# EAGLE board badge (EAGLE 8.3.1)
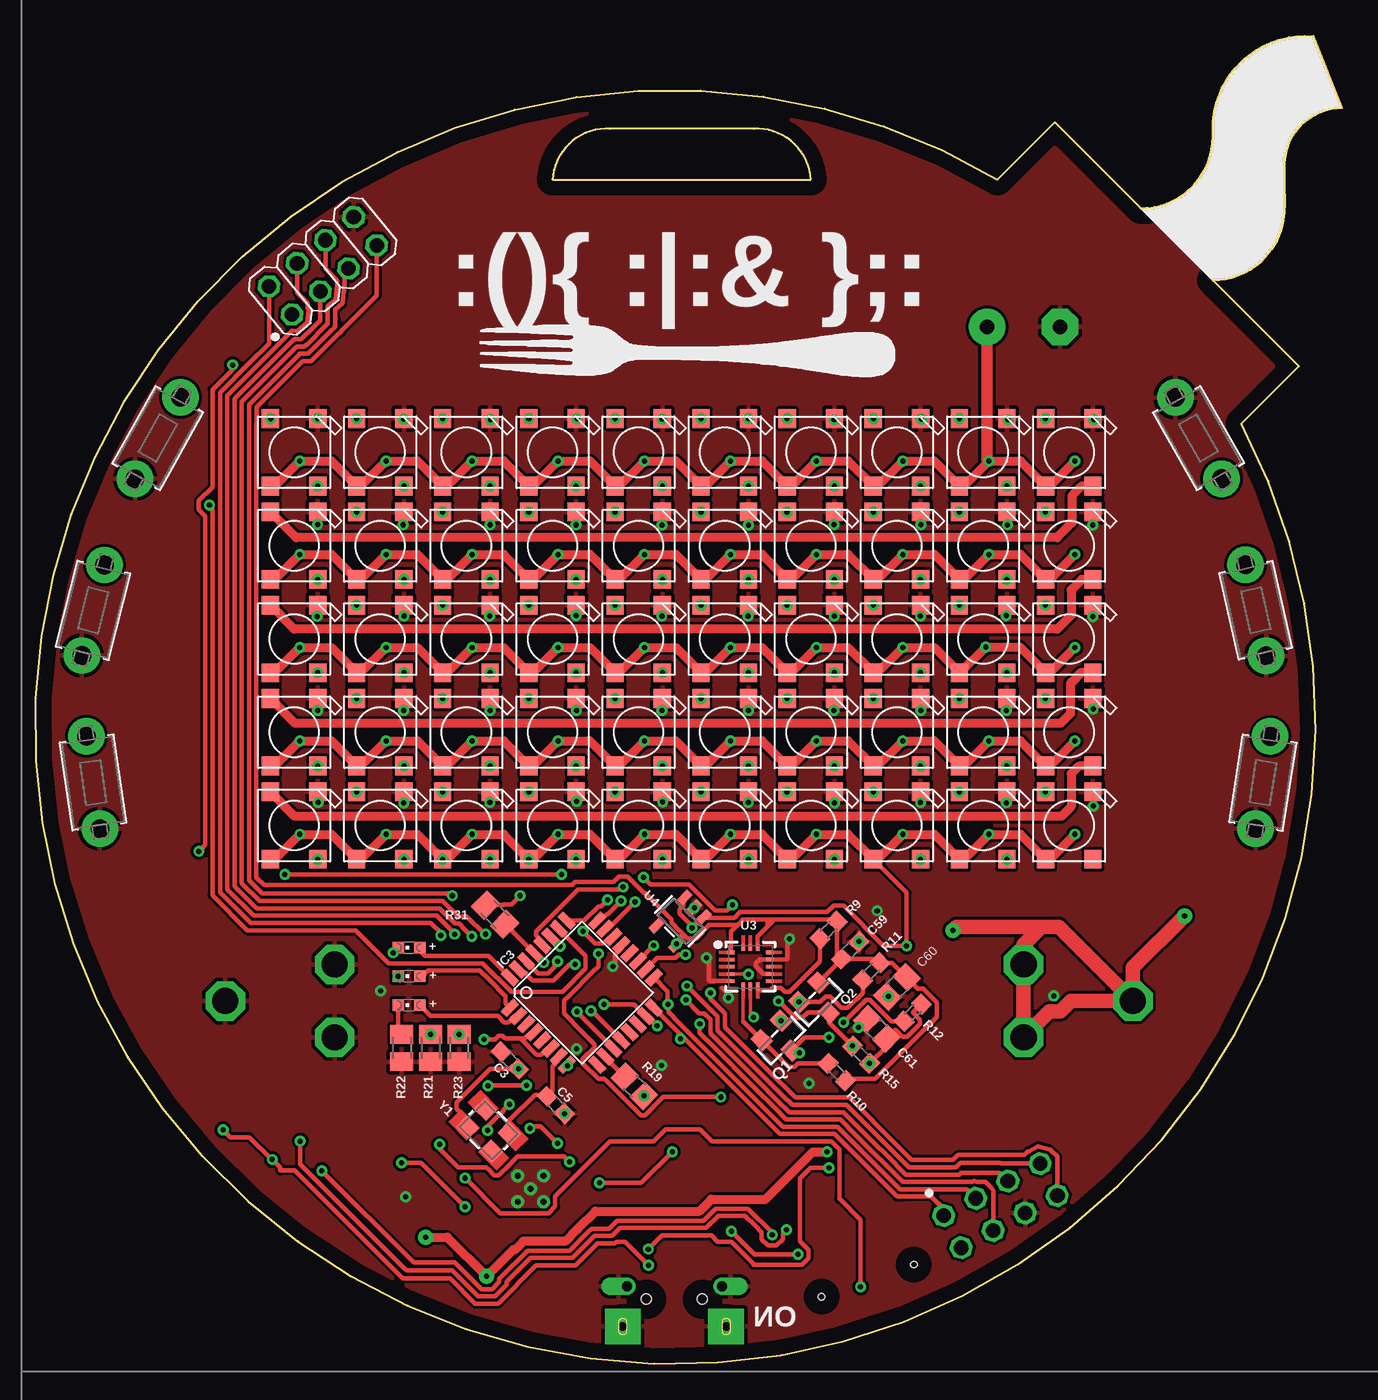
[diagram p2: board, top side]
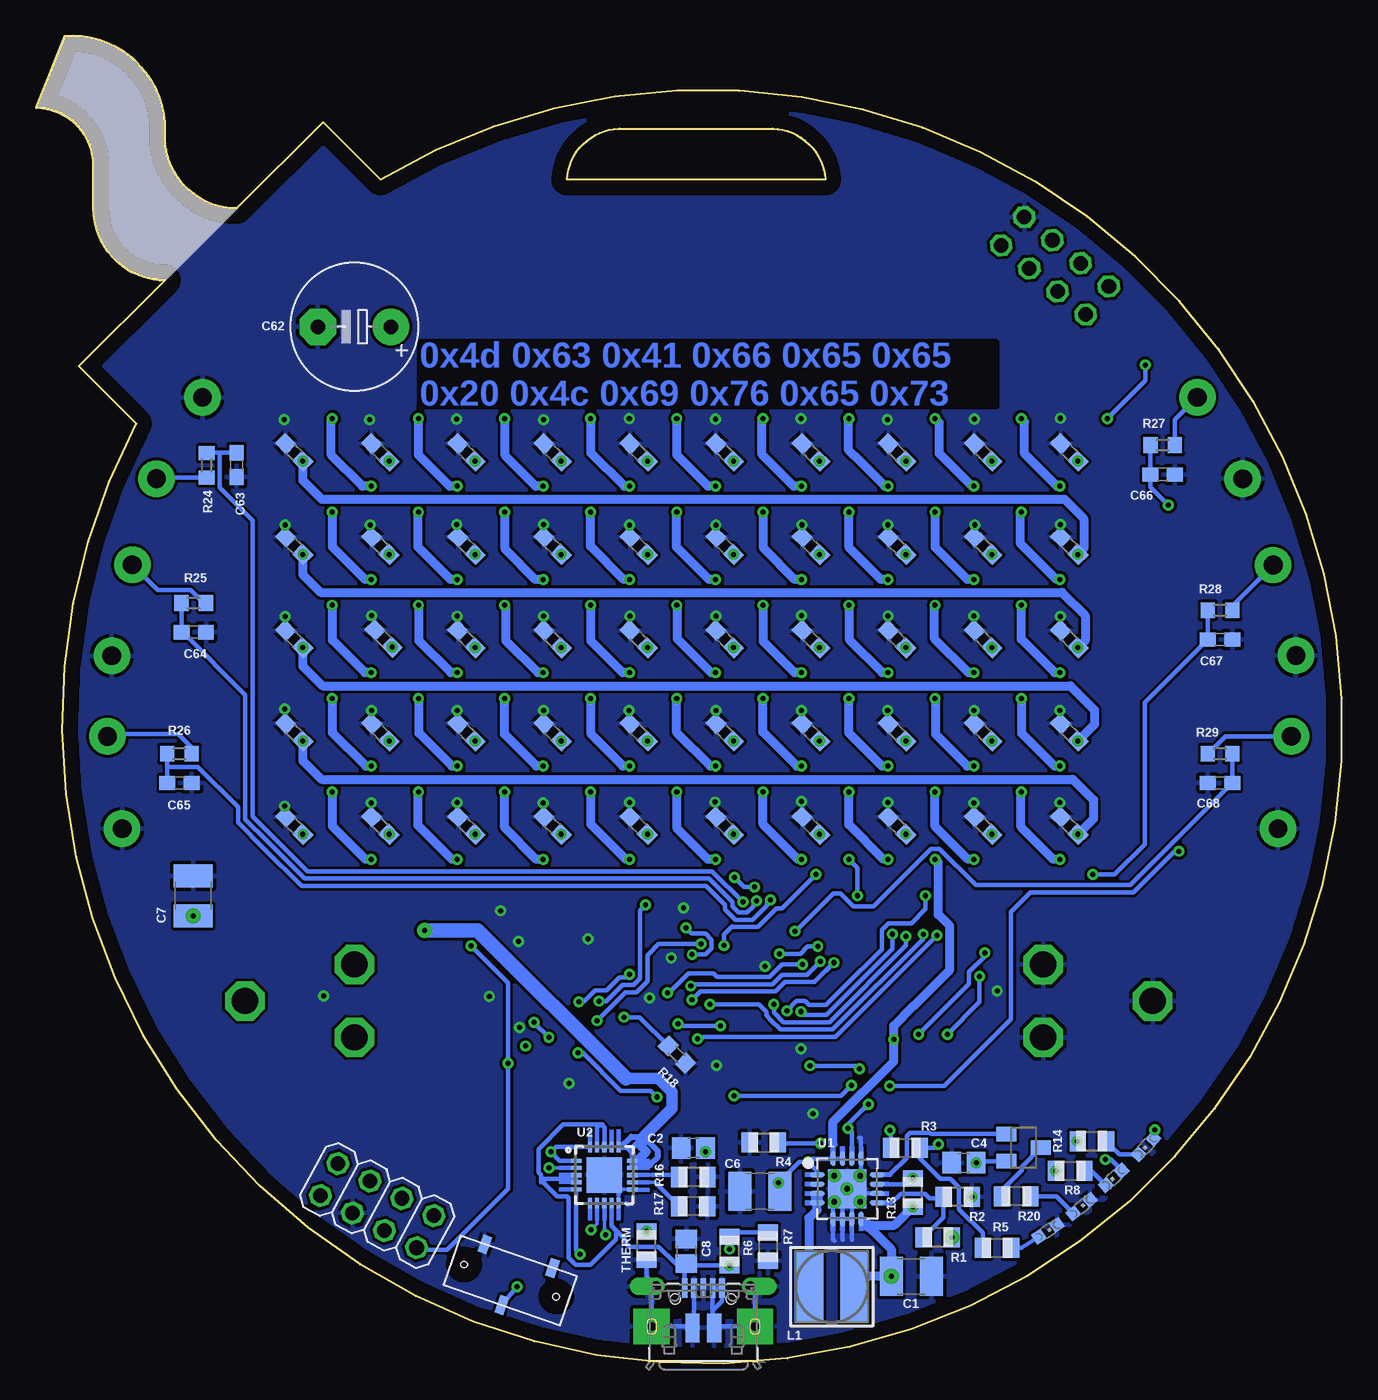
[diagram p3: board, bottom side, seen from below]

Size 90.99 x 92.5 mm. Coordinates in mm from the lower left corner, seen from the top.
Outline: 11.63,14.43 arc-163 66.99,82.48 70.99,86.48 76.99,80.48 arc90 81.99,85.48 81.99,86.48 arc-90 88.99,92.48 90.99,87.48 arc90 86.99,83.48 86.99,80.48 arc-90 81.99,75.48 87.99,69.48 83.99,65.48 arc-165 11.63,14.43
Outline: 40.01,86.03 arc90 35.99,82.48 53.99,82.48 arc90 50.01,86.03 40.01,86.03
Copper layers (1*16): Top 0.035mm / dielectric 1.5mm / Bottom 0.035mm
Design rules "default *": minimum track width 8mil, minimum drill 0.35mm, track to track 8mil, track to pad 8mil, pad to pad 8mil, via to via 8mil, smd to smd 0mil, copper to edge 40mil, drill to drill 8mil, minimum pad ring 10mil, minimum via ring 8mil, stop-mask expansion 4mil, vias tented up to drill 0mil, thermal gap 10mil

## Footprints (pad centres in the part's own frame; a part is rotated, then mirrored left to right if it is on the bottom)
C1210 = smd 1.6 x 2.7: 1 -1.4,0; 2 1.4,0
C0805 = smd 1.3 x 1.5: 1 -0.85,0; 2 0.85,0
C0603 = smd 1.1 x 1: 1 -0.85,0; 2 0.85,0
C0805' = smd 1.3 x 1.5: 1 -0.95,0; 2 0.95,0
E5-8,5 = drill 1.016 pad 2.54: + -2.54,0 | drill 1.016 pad 2.54 octagon: - 2.54,0
ADAFRUIT_CHIPLED_0603 = smd 0.8 x 0.8: A 0,-0.75; C 0,0.75
4UCONN_20329 = smd 1 x 2: BASE@1 -0.75,-2; BASE@2 0.75,-2 | smd 0.4 x 1.35: D+ 0,0.775; D- -0.65,0.775; GND 1.3,0.775; ID 0.65,0.775; VBUS -1.3,0.775 | drill 0.7 offset: SPRT@1 -3.3,0.9; SPRT@2 3.3,0.9 | drill 0.6 pad 2.5 square: SPRT@3 -3.6,-1.9; SPRT@4 3.6,-1.9 | hole 0.7: -1.95,0; 1.95,0
TQFP32-08 = smd 1.27 x 0.559: 1 -4.293,2.8; 2 -4.293,2; 3 -4.293,1.2; 4 -4.293,0.4; 5 -4.293,-0.4; 6 -4.293,-1.2; 7 -4.293,-2; 8 -4.293,-2.8; 17 4.293,-2.8; 18 4.293,-2; 19 4.293,-1.2; 20 4.293,-0.4; 21 4.293,0.4; 22 4.293,1.2; 23 4.293,2; 24 4.293,2.8 | smd 0.559 x 1.27: 9 -2.8,-4.293; 10 -2,-4.293; 11 -1.2,-4.293; 12 -0.4,-4.293; 13 0.4,-4.293; 14 1.2,-4.293; 15 2,-4.293; 16 2.8,-4.293; 25 2.8,4.293; 26 2,4.293; 27 1.2,4.293; 28 0.4,4.293; 29 -0.4,4.293; 30 -1.2,4.293; 31 -2,4.293; 32 -2.8,4.293
2X04 = drill 1.016 octagon: 1 -3.81,-1.27; 2 -3.81,1.27; 3 -1.27,-1.27; 4 -1.27,1.27; 5 1.27,-1.27; 6 1.27,1.27; 7 3.81,-1.27; 8 3.81,1.27
INDUCTOR_5X5MM_TDK_VLC5045 = smd 2 x 5: P$1 -1.6,0; P$2 1.6,0
WS2812B-NARROW = smd 1.3 x 1.2: 1-VDD 2.35,-1.65; 2-DOUT 2.35,1.65; 3-GND -2.35,1.65; 4-DIN -2.35,-1.65
SOT23-WIDE = smd 1 x 1.2: 1 -0.95,-1; 2 0.95,-1; 3 0,1
R0805 = smd 1.1 x 1.4: 1 -1,0; 2 1,0
R0603 = smd 1 x 1.1: 1 -0.85,0; 2 0.85,0
R0805' = smd 1.3 x 1.5: 1 -0.95,0; 2 0.95,0
M0805 = smd 1.3 x 1.6: 1 -0.95,0; 2 0.95,0
TACT_PANA-EVQ = drill 1.3 pad 2.54: P$1 -3.25,0; P$2 3.25,0
TRANSISTOR_SC59-BEC = smd 1 x 1.4: B -0.95,-1.2; C 0,1.2; E 0.95,-1.2
PVQFN-16 = smd 1.05 x 0.35: 1 -2.1,0.975; 2 -2.1,0.325; 3 -2.1,-0.325; 4 -2.1,-0.975; 9 2.1,-0.975; 10 2.1,-0.325; 11 2.1,0.325; 12 2.1,0.975 | smd 0.35 x 1.05: 5 -0.975,-2.1; 6 -0.325,-2.1; 7 0.325,-2.1; 8 0.975,-2.1; 13 0.975,2.1; 14 0.325,2.1; 15 -0.325,2.1; 16 -0.975,2.1 | drill 0.4: P$18 0,0; P$19 -0.9,0.9; P$20 0.9,0.9; P$21 0.9,-0.9; P$22 -0.9,-0.9 | smd 2.7 x 2.7: THERMAL 0,0
QFN20_4MM = smd 0.73 x 0.28: P$1 -1.965,1; P$2 -1.965,0.5; P$3 -1.965,0; P$4 -1.965,-0.5; P$5 -1.965,-1; P$11 1.965,-1; P$12 1.965,-0.5; P$13 1.965,0; P$14 1.965,0.5; P$15 1.965,1 | smd 0.28 x 0.73: P$6 -1,-1.965; P$7 -0.5,-1.965; P$8 0,-1.965; P$9 0.5,-1.965; P$10 1,-1.965; P$16 1,1.965; P$17 0.5,1.965; P$18 0,1.965; P$19 -0.5,1.965; P$20 -1,1.965 | smd 2.5 x 2.5: P$21 0,0
LGA16_3X3MM = smd 0.5 x 0.25: 1 -1.35,1; 2 -1.35,0.5; 3 -1.35,0; 4 -1.35,-0.5; 5 -1.35,-1; 9 1.35,-1; 10 1.35,-0.5; 11 1.35,0; 12 1.35,0.5; 13 1.35,1 | smd 0.25 x 0.5: 6 -0.5,-1.35; 7 0,-1.35; 8 0.5,-1.35; 14 0.5,1.35; 15 0,1.35; 16 -0.5,1.35
SOT23-5 = smd 0.55 x 1.2: 1 -0.95,-1.3; 2 0,-1.3; 3 0.95,-1.3; 4 0.95,1.3; 5 -0.95,1.3
CL-SB-12A-02T = smd 0.635 x 1.27: P$1 -2.5,-1.8; P$2 0,1.8; P$3 2.5,-1.8 | hole 0.45: 3.4,0; -3.4,0
54_BATTERY_CLIP = drill 1.83 octagon: P$1 -24,2.54; P$2 -24,-2.54; P$3 -31.62,0; P$4 24,2.54; P$5 24,-2.54; P$6 31.62,0
CRYSTAL-SMD-3.2X2.5MM = smd 1.2 x 1.1: 1 -1.175,-0.875; 2 1.175,-0.875; 3 1.175,0.875; 4 -1.175,0.875

## Placement (x,y rotation side)
C1  10uF  [C1210]  30,6.08 0 bottom
C2  2.2uF  [C0805]  45.19,15.03 180 bottom
C3  22pF  [C0603]  33.01,21.13 135 top
C4  0.1uF  [C0805]  26.33,13.99 180 bottom
C5  22pF  [C0603]  36.22,18.02 315 top
C6  10uF  [C1210]  40.55,12 180 bottom
C7  10uF  [C1210]  80.03,32.59 90 bottom
C8  10uf  [C0805]  45.67,7.83 90 bottom
C9  100nF  [C0603]  18.99,63.48 135 bottom
C10  100nF  [C0603]  30.99,63.48 135 bottom
C11  100nF  [C0603]  36.99,63.48 135 bottom
C12  100nF  [C0603]  42.99,63.48 135 bottom
C13  100nF  [C0603]  48.99,63.48 135 bottom
C14  100nF  [C0603]  54.99,63.48 135 bottom
C15  100nF  [C0603]  60.99,63.48 135 bottom
C16  100nF  [C0603]  66.99,63.48 135 bottom
C17  100nF  [C0603]  72.99,63.48 135 bottom
C18  100nF  [C0603]  18.99,56.98 135 bottom
C19  100nF  [C0603]  24.99,56.98 135 bottom
C20  100nF  [C0603]  30.99,56.98 135 bottom
C21  100nF  [C0603]  36.99,56.98 135 bottom
C22  100nF  [C0603]  42.99,56.98 135 bottom
C23  100nF  [C0603]  48.99,56.98 135 bottom
C24  100nF  [C0603]  54.99,56.98 135 bottom
C25  100nF  [C0603]  60.99,56.98 135 bottom
C26  100nF  [C0603]  66.99,56.98 135 bottom
C27  100nF  [C0603]  72.99,56.98 135 bottom
C28  100nF  [C0603]  18.99,50.48 135 bottom
C29  100nF  [C0603]  24.99,50.48 135 bottom
C30  100nF  [C0603]  30.99,50.48 135 bottom
C31  100nF  [C0603]  36.99,50.48 135 bottom
C32  100nF  [C0603]  42.99,50.48 135 bottom
C33  100nF  [C0603]  48.99,50.48 135 bottom
C34  100nF  [C0603]  54.99,50.48 135 bottom
C35  100nF  [C0603]  60.99,50.48 135 bottom
C36  100nF  [C0603]  66.77,50.51 135 bottom
C37  100nF  [C0603]  72.99,50.48 135 bottom
C38  100nF  [C0603]  18.99,43.98 135 bottom
C39  100nF  [C0603]  24.99,43.98 135 bottom
C40  100nF  [C0603]  30.99,43.98 135 bottom
C41  100nF  [C0603]  36.99,43.98 135 bottom
C42  100nF  [C0603]  42.99,43.98 135 bottom
C43  100nF  [C0603]  48.99,43.98 135 bottom
C44  100nF  [C0603]  54.99,43.98 135 bottom
C45  100nF  [C0603]  60.99,43.98 135 bottom
C46  100nF  [C0603]  66.99,43.98 135 bottom
C47  100nF  [C0603]  72.99,43.98 135 bottom
C48  100nF  [C0603]  18.99,37.48 135 bottom
C49  100nF  [C0603]  24.99,37.48 135 bottom
C50  100nF  [C0603]  30.99,37.48 135 bottom
C51  100nF  [C0603]  36.99,37.48 135 bottom
C52  100nF  [C0603]  42.99,37.48 135 bottom
C53  100nF  [C0603]  48.99,37.48 135 bottom
C54  100nF  [C0603]  54.99,37.48 135 bottom
C55  100nF  [C0603]  60.99,37.48 135 bottom
C56  100nF  [C0603]  66.99,37.48 135 bottom
C57  100nF  [C0603]  72.99,37.48 135 bottom
C58  100nF  [C0603]  24.99,63.48 135 bottom
C59  0.1uF  [C0603]  56.73,28.79 45 top
C60  10µF  [C0805']  59.99,26.24 225 top
C61  10µF  [C0805']  58.58,23.32 135 top
C62  1F  [E5-8,5]  68.81,72.24 180 bottom
C63  100nF  [C0603]  77,62.61 270 bottom
C64  100nF  [C0603]  79.99,50.96 0 bottom
C65  100nF  [C0603]  80.99,40.45 0 bottom
C66  100nF  [C0603]  12.49,61.94 0 bottom
C67  100nF  [C0603]  8.49,50.44 0 bottom
C68  100nF  [C0603]  8.49,40.45 180 bottom
CHRG/LBO  ORANGE  [ADAFRUIT_CHIPLED_0603]  15.89,12.94 132.8 bottom
CN4  MicroUSB  [4UCONN_20329]  44.49,4.48 0 bottom
DONE  GREEN  [ADAFRUIT_CHIPLED_0603]  13.65,15.13 136.3 bottom
IC3  MEGA8-AI  [TQFP32-08]  38.04,25.84 45 top
JP1  PROG_HEADER  [2X04]  67.21,11 151.5 bottom
JP3  TCVR_HEADER  [2X04]  19.99,76.48 39.3 top
L1  6.8uH  [INDUCTOR_5X5MM_TDK_VLC5045]  35.54,5.36 180 bottom
LBO  RED  [ADAFRUIT_CHIPLED_0603]  18.13,10.94 309.5 bottom
LED1  WS2812B5050-NARROW  [WS2812B-NARROW]  17.99,63.48 270 top
LED2  WS2812B5050-NARROW  [WS2812B-NARROW]  23.99,63.48 270 top
LED3  WS2812B5050-NARROW  [WS2812B-NARROW]  29.99,63.48 270 top
LED4  WS2812B5050-NARROW  [WS2812B-NARROW]  35.99,63.48 270 top
LED5  WS2812B5050-NARROW  [WS2812B-NARROW]  41.99,63.48 270 top
LED6  WS2812B5050-NARROW  [WS2812B-NARROW]  47.99,63.48 270 top
LED7  WS2812B5050-NARROW  [WS2812B-NARROW]  53.99,63.48 270 top
LED8  WS2812B5050-NARROW  [WS2812B-NARROW]  59.99,63.48 270 top
LED9  WS2812B5050-NARROW  [WS2812B-NARROW]  65.99,63.48 270 top
LED10  WS2812B5050-NARROW  [WS2812B-NARROW]  71.99,63.48 270 top
LED11  WS2812B5050-NARROW  [WS2812B-NARROW]  17.99,56.98 270 top
LED12  WS2812B5050-NARROW  [WS2812B-NARROW]  23.99,56.98 270 top
LED13  WS2812B5050-NARROW  [WS2812B-NARROW]  29.99,56.98 270 top
LED14  WS2812B5050-NARROW  [WS2812B-NARROW]  35.99,56.98 270 top
LED15  WS2812B5050-NARROW  [WS2812B-NARROW]  41.99,56.98 270 top
LED16  WS2812B5050-NARROW  [WS2812B-NARROW]  47.99,56.98 270 top
LED17  WS2812B5050-NARROW  [WS2812B-NARROW]  53.99,56.98 270 top
LED18  WS2812B5050-NARROW  [WS2812B-NARROW]  59.99,56.98 270 top
LED19  WS2812B5050-NARROW  [WS2812B-NARROW]  65.99,56.98 270 top
LED20  WS2812B5050-NARROW  [WS2812B-NARROW]  71.99,56.98 270 top
LED21  WS2812B5050-NARROW  [WS2812B-NARROW]  17.99,50.48 270 top
LED22  WS2812B5050-NARROW  [WS2812B-NARROW]  23.99,50.48 270 top
LED23  WS2812B5050-NARROW  [WS2812B-NARROW]  29.99,50.48 270 top
LED24  WS2812B5050-NARROW  [WS2812B-NARROW]  35.99,50.48 270 top
LED25  WS2812B5050-NARROW  [WS2812B-NARROW]  41.99,50.48 270 top
LED26  WS2812B5050-NARROW  [WS2812B-NARROW]  47.99,50.48 270 top
LED27  WS2812B5050-NARROW  [WS2812B-NARROW]  53.99,50.48 270 top
LED28  WS2812B5050-NARROW  [WS2812B-NARROW]  59.99,50.48 270 top
LED29  WS2812B5050-NARROW  [WS2812B-NARROW]  65.99,50.48 270 top
LED30  WS2812B5050-NARROW  [WS2812B-NARROW]  71.99,50.48 270 top
LED31  WS2812B5050-NARROW  [WS2812B-NARROW]  17.99,43.98 270 top
LED32  WS2812B5050-NARROW  [WS2812B-NARROW]  23.99,43.98 270 top
LED33  WS2812B5050-NARROW  [WS2812B-NARROW]  29.99,43.98 270 top
LED34  WS2812B5050-NARROW  [WS2812B-NARROW]  35.99,43.98 270 top
LED35  WS2812B5050-NARROW  [WS2812B-NARROW]  41.99,43.98 270 top
LED36  WS2812B5050-NARROW  [WS2812B-NARROW]  47.99,43.98 270 top
LED37  WS2812B5050-NARROW  [WS2812B-NARROW]  53.99,43.98 270 top
LED38  WS2812B5050-NARROW  [WS2812B-NARROW]  59.99,43.98 270 top
LED39  WS2812B5050-NARROW  [WS2812B-NARROW]  65.99,43.98 270 top
LED40  WS2812B5050-NARROW  [WS2812B-NARROW]  71.99,43.98 270 top
LED41  WS2812B5050-NARROW  [WS2812B-NARROW]  17.99,37.48 270 top
LED42  WS2812B5050-NARROW  [WS2812B-NARROW]  23.99,37.48 270 top
LED43  WS2812B5050-NARROW  [WS2812B-NARROW]  29.99,37.48 270 top
LED44  WS2812B5050-NARROW  [WS2812B-NARROW]  35.99,37.48 270 top
LED45  WS2812B5050-NARROW  [WS2812B-NARROW]  41.99,37.48 270 top
LED46  WS2812B5050-NARROW  [WS2812B-NARROW]  47.99,37.48 270 top
LED47  WS2812B5050-NARROW  [WS2812B-NARROW]  53.99,37.48 270 top
LED48  WS2812B5050-NARROW  [WS2812B-NARROW]  59.99,37.48 270 top
LED49  WS2812B5050-NARROW  [WS2812B-NARROW]  65.99,37.48 270 top
LED50  WS2812B5050-NARROW  [WS2812B-NARROW]  71.99,37.48 270 top
ON  BLUE  [ADAFRUIT_CHIPLED_0603]  20.49,9.26 303.2 bottom
Q1  BSS138  [SOT23-WIDE]  51.94,22.51 225 top
Q2  BSS138  [SOT23-WIDE]  54.54,25.17 225 top
R1  1.87M  [R0805]  28.16,8.81 0 bottom
R2  340K  [R0805]  26.77,11.61 180 bottom
R3  1.87M  [R0805]  30.41,15.03 0 bottom
R4  200K  [R0805]  40.27,15.4 0 bottom
R5  1K  [R0805]  24.03,8.07 0 bottom
R6  270K  [R0805]  42.68,7.85 270 bottom
R7  100K  [R0805]  39.99,8.15 270 bottom
R8  1K  [R0805]  18.92,13.44 0 bottom
R9  10K  [R0603]  55.23,30.22 225 top
R10  10K  [R0603]  55.8,20.31 315 top
R11  10K  [R0603]  58.21,27.33 45 top
R12  10K  [R0603]  61.09,24.45 45 top
R13  200K  [R0805]  29.89,11.93 90 bottom
R14  1K  [R0805]  17.42,15.5 0 bottom
R15  10K  [R0603]  57.49,21.52 315 top
R16  1.0K  [R0805]  45.18,13 180 bottom
R17  100K  [R0805]  45.2,10.97 180 bottom
R18  10K  [R0603]  46.33,21.53 135 bottom
R19  470  [R0805']  41.69,19.32 315 top
R20  1K  [R0805]  22.68,11.65 180 bottom
R21  220  [M0805]  27.49,21.98 90 top
R22  220  [M0805]  25.49,21.98 90 top
R23  220  [M0805]  29.49,21.98 90 top
R24  1k  [R0603]  79.09,62.58 270 bottom
R25  1k  [R0603]  79.99,52.98 0 bottom
R26  1k  [R0603]  80.99,42.48 0 bottom
R27  1k  [R0603]  12.49,63.98 0 bottom
R28  1k  [R0603]  8.49,52.48 0 bottom
R29  1k  [R0603]  8.49,42.48 180 bottom
R31  10k  [M0805]  32,31.28 135 top
STAT1  GREEN  [ADAFRUIT_CHIPLED_0603]  25.99,28.98 90 top
STAT2  GREEN  [ADAFRUIT_CHIPLED_0603]  25.99,26.98 90 top
STAT3  GREEN  [ADAFRUIT_CHIPLED_0603]  25.99,24.98 90 top
SW1  [TACT_PANA-EVQ]  80.99,64.48 299.6 top
SW2  [TACT_PANA-EVQ]  84.99,52.48 102.7 top
SW3  [TACT_PANA-EVQ]  85.49,40.48 81 top
SW4  [TACT_PANA-EVQ]  8.49,64.48 60.9 top
SW5  [TACT_PANA-EVQ]  3.99,52.48 75.9 top
SW6  [TACT_PANA-EVQ]  3.99,40.48 98.2 top
T1  MMUN2133LT1G  [TRANSISTOR_SC59-BEC]  22.17,15.05 270 bottom
THERM  15K  [R0805]  48.45,8.23 90 bottom
U1  TPS61090RSAR  [PVQFN-16]  34.47,12.18 0 bottom
U2  MCP73871  [QFN20_4MM]  51.39,13.14 0 bottom
U3  LIS3DHTR  [LGA16_3X3MM]  49.78,27.65 0 top
U4  MIC5225-3.3  [SOT23-5]  44.89,30.82 135 top
U$17  CL-SB-12A-02T  [CL-SB-12A-02T]  57.95,5.78 160.8 bottom
U$22  54_BATTERY_CLIP  [54_BATTERY_CLIP]  44.81,25.27 180 top
Y1  16.00MHz  [CRYSTAL-SMD-3.2X2.5MM]  31.53,16.26 315 top

## Tracks (layer width: path | path; a pad name or v marks a point on that pad's centre or on a via)
3.3V  (via drill 0.35 pad 0.6)
  Top 0.305: U3.14 50.28,29.77 50.98,30.48 | 50.98,30.48 51.45,30.95 | 51.45,30.95 55.7,30.95 R9.1 55.83,28.5 C59.1 | C59.1 56.13,28.17 Q2.1 | C59.1 58.55,28.19 R11.2 59.65,27.93 C60.1 61.47,26.11 61.51,26.15 61.8,26.15 62.79,25.17 62.79,24.57 62.79,24.15 58.46,19.82 56.51,19.82 R10.2 | 44.66,29.21 U4.5 | 50.98,30.95 49.28,30.95 49.08,30.75 | 50.98,30.95 51.45,30.95 | 49.08,30.75 48.43,30.1 U3.1 | 50.98,30.95 50.98,30.48 | 44.56,29.1 44.66,29.21 | 44.66,29.21 44.98,29.52 44.98,30.04 44.86,30.16 | 44.86,30.16 44.27,30.74 44.27,30.95 42.42,32.8 42.36,32.8 41.22,33.93 40.62,33.93 40.24,33.56 37.57,33.56 37.34,33.33 15.91,33.33 15.36,33.88 15.36,65.48 15.39,65.51 15.39,66.63 18.6,69.84 18.63,69.84 | 49.08,30.75 | 49.08,30.75 48.89,30.56 46.91,30.56 46.44,30.09 46.44,30.05 46.01,29.62 45.41,29.62 44.87,30.16 44.86,30.16 | JP3.7 23.74,74.42 21.29,71.97 21.29,71.94 21.27,71.92 21.27,71.89 | 18.63,69.84 | 18.63,69.84 19.17,69.84 20.98,71.65 21.26,71.89 | 21.27,71.89 | 21.27,71.89 | 21.27,71.89 21.26,71.89 | 21.26,71.89
  Bottom 0.305: U4.5 47.61,29.23 48.4,28.45 48.4,26.61 49.13,25.88 49.92,25.88 Q1.1
  other vias: 51.9,23.89 44.64,29.23
+5V  (via drill 0.35, 0.35 pad 0.6)
  Top 0.305: 32.96,13.83 32.23,13.11 31.93,13.12 31.57,13.5 31.37,13.69 29.4,13.69 28.12,14.97 v28.12,15.27 | v37.18,14.05 36.79,14.44 33.57,14.44 33.33,14.19 32.96,13.83 | 32.96,13.83 | IC3.4 34.49,23.09 34.05,22.66 33.76,22.66 | IC3.6 35.62,21.96 35.19,21.52 34.89,21.52 33.76,22.66 | 46.5,31.07 U4.1 | R12.2 61.09,24.46 61.59,23.96 61.59,23.67 60.67,22.75 60.38,22.75 59.88,23.25 59.29,22.65 C61.1 59.25,22.08 R15.2 | U4.1 46.42,31.07 v45.71,30.36 45.71,30.49 44.83,31.36 44.83,31.66 45.14,31.96 U4.3 | v39.26,12.59 42.17,12.59 v44.34,14.75 | R31.2 32.59,31.95 32.63,31.99 33.13,31.99 v33.74,32.6 | LED48.1-VDD 60.66,32.81 v60.66,29.11 59.06,29.11 56.25,31.92 55.58,31.92 55.13,31.46 49.07,31.46 48.68,31.07 U4.1 | v31.23,22.6 32,22.6 32.23,22.83 32.52,22.83 32.7,22.66 33.76,22.66 | v45.27,28.5 44.8,28.5 44.56,28.26 43.28,28.26 IC3.18
  Top 0.61: LED1.1-VDD 16.64,61.13 C9.1 20.59,62.88 LED2.1-VDD 22.64,61.13 C58.1 26.59,62.88 LED3.1-VDD 28.64,61.13 C10.1 32.59,62.88 LED4.1-VDD 34.64,61.13 C11.1 38.59,62.88 LED5.1-VDD 40.64,61.13 C12.1 44.59,62.88 LED6.1-VDD 46.64,61.13 C13.1 50.59,62.88 LED7.1-VDD 52.64,61.13 C14.1 56.59,62.88 LED8.1-VDD 58.64,61.13 C15.1 62.59,62.88 LED9.1-VDD 64.64,61.13 C16.1 68.59,62.88 LED10.1-VDD 70.64,61.13 C17.1 | LED11.1-VDD 16.64,54.63 C18.1 20.59,56.38 LED12.1-VDD 22.64,54.63 C19.1 26.59,56.38 LED13.1-VDD 28.64,54.63 C20.1 32.59,56.38 LED14.1-VDD 34.64,54.63 C21.1 38.59,56.38 LED15.1-VDD 40.64,54.63 C22.1 44.59,56.38 LED16.1-VDD 46.64,54.63 C23.1 50.59,56.38 LED17.1-VDD 52.64,54.63 C24.1 56.59,56.38 LED18.1-VDD 58.64,54.63 C25.1 62.59,56.38 LED19.1-VDD 64.64,54.63 C26.1 68.59,56.38 LED20.1-VDD 70.64,54.63 C27.1 | LED21.1-VDD 16.64,48.13 C28.1 20.59,49.88 LED22.1-VDD 22.64,48.13 C29.1 26.59,49.88 LED23.1-VDD 28.64,48.13 C30.1 32.59,49.88 LED24.1-VDD 34.64,48.13 C31.1 38.59,49.88 LED25.1-VDD 40.64,48.13 C32.1 44.59,49.88 LED26.1-VDD 46.64,48.13 C33.1 50.59,49.88 LED27.1-VDD 52.64,48.13 C34.1 56.59,49.88 LED28.1-VDD 58.64,48.13 C35.1 62.59,49.88 LED29.1-VDD 64.39,48.13 C36.1 68.56,49.91 LED30.1-VDD 70.64,48.13 C37.1 | LED31.1-VDD 16.64,41.63 C38.1 20.59,43.38 LED32.1-VDD 22.64,41.63 C39.1 26.59,43.38 LED33.1-VDD 28.64,41.63 C40.1 32.59,43.38 LED34.1-VDD 34.64,41.63 C41.1 38.59,43.38 LED35.1-VDD 40.64,41.63 C42.1 44.59,43.38 LED36.1-VDD 46.64,41.63 C43.1 50.59,43.38 LED37.1-VDD 52.64,41.63 C44.1 56.59,43.38 LED38.1-VDD 58.64,41.63 C45.1 62.59,43.38 LED39.1-VDD 64.64,41.63 C46.1 68.59,43.38 LED40.1-VDD 70.64,41.63 C47.1
  Top 0.61: C57.1 70.64,35.13 LED50.1-VDD 68.59,36.88 C56.1 64.64,35.13 LED49.1-VDD 62.59,36.88 C55.1 58.64,35.13 LED48.1-VDD 56.59,36.88 C54.1 52.64,35.13 LED47.1-VDD 50.59,36.88 C53.1 46.64,35.13 LED46.1-VDD 44.59,36.88 C52.1 40.64,35.13 LED45.1-VDD 38.59,36.88 C51.1 34.64,35.13 LED44.1-VDD 32.59,36.88 C50.1 28.64,35.13 LED43.1-VDD 26.59,36.88 C49.1 22.64,35.13 LED42.1-VDD 20.59,36.88 C48.1 16.64,35.13 LED41.1-VDD
  Top 0.813: C62.+ 66.27,63.01 C16.1
  Bottom 0.254: U1.16 35.45,15.28
  Bottom 0.305: U1.15 U1.16 36.95,14.28 v37.18,14.05 | U1.1 36.57,13.43 v37.18,14.05 | R5.1 25.03,9.12 26.67,10.77 26.67,12.3 27.26,12.88 27.98,12.88 29.41,14.32 R3.2 28.36,15.04 v28.12,15.27 | JP1.2 64.31,7.91 62.35,7.91 58.09,12.18 R15.2 58.09,26.53 v60.66,29.11 | v45.71,30.36 45.32,29.96 44.34,29.96 43.91,29.53 43.91,28.93 44.34,28.5 v45.27,28.5 | C6.1 39.15,12.48 v39.26,12.59 37.8,14.05 v37.18,14.05 | v33.74,32.6 33.74,34.54 LED44.1-VDD | C2.1 v44.34,14.75
  Bottom 0.61: C17.1 72.39,61.54 71.07,60.22 19.34,60.22 18.39,59.28 | 18.39,59.28 | 18.39,59.28 17.98,58.87 17.98,56.79 C18.1 | C27.1 72.39,54.97 71.15,53.74 19.51,53.74 17.88,52.11 17.88,50.39 C28.1 | C37.1 72.39,48.6 71.01,47.22 18.92,47.22 17.24,45.54 17.24,44.54 C38.1 | C47.1 72.39,42.01 71.09,40.71 18.75,40.71 17.31,39.28 17.31,37.96 C48.1 | 35.45,15.28 35.45,16.85 31.23,21.07 v31.23,22.6 31.23,23.55 29.87,24.9 29.86,24.9 27.33,27.44 27.33,30.49 28.13,31.29 28.13,34.92 LED43.1-VDD
  other vias: 18.39,62.88 24.39,62.88 30.39,62.88 36.39,62.88 42.39,62.88 48.39,62.88 54.39,62.88 60.39,62.88 66.39,62.88 72.39,62.88 18.39,56.38 24.39,56.38 30.39,56.38 36.39,56.38 42.39,56.38 48.39,56.38 54.39,56.38 60.39,56.38 66.39,56.38 72.39,56.38 18.39,49.88 24.39,49.88 30.39,49.88 36.39,49.88 42.39,49.88 48.39,49.88 54.39,49.88 60.39,49.88 66.17,49.91 72.39,49.88 18.39,43.38 24.39,43.38 30.39,43.38 36.39,43.38 42.39,43.38 48.39,43.38 54.39,43.38 60.39,43.38 66.39,43.38 72.39,43.38 18.39,36.88 24.39,36.88 30.39,36.88 36.39,36.88 42.39,36.88 48.39,36.88 54.39,36.88 60.39,36.88 66.39,36.88 72.39,36.88 58.09,20.92 28.34,35.13 34.34,35.13
BOOST_ENABLE  (via drill 0.35, 0.35 pad 0.6)
  Top 0.305: 39.54,15.02 | 39.54,15.02 40,15.49 43.03,15.49 43.86,16.31 46.28,16.31 47.1,15.49 55.42,15.49 55.97,14.93 55.97,11.47 56.01,11.47 57.46,10.03 v57.46,5.36 | R13.2 32.35,10.47 35.71,10.47 36.18,10.94 36.18,11.66 39.54,15.02
  Bottom 0.305: U1.11 30.32,12.5 R13.2 | v57.46,5.36 U$17.P$2
  other vias: 29.89,12.93
CE  (via drill 0.35 pad 0.6)
  Top 0.305: JP3.6 20.17,76.29 21,75.46 20.97,75.43 20.97,75.05 20.96,74.9 | v37.7,24.52 37.7,24.49 IC3.11 | 20.3,72.41 20.3,72.44 20.32,72.46 20.34,72.66 20.34,73.68 20.88,74.13 20.96,74.9 | 20.3,72.41 | 20.96,74.9 | 20.3,72.41 18.86,70.97 18.81,70.97 18.7,70.86 18.21,70.86 18.18,70.86 14.35,67.03 14.35,33.46 15.58,32.23 28.35,32.23 29.42,31.16 30.01,31.16 31.25,29.92 v31.33,29.92
  Bottom 0.305: v31.33,29.92 31.33,28.88 35.91,24.3 37.47,24.3 v37.7,24.52
CSN  (via drill 0.35 pad 0.6)
  Top 0.305: v38.67,24.58 38.74,24.58 IC3.12 | v29.01,32.6 28.86,32.76 15.77,32.76 14.86,33.67 14.86,66.82 18.33,70.29 | 20.8,72.2 20.78,72.18 20.78,72.15 20.64,72.03 | 20.8,72.2 | 20.8,72.2 | 20.8,72.2 20.81,72.23 20.85,72.27 20.85,72.64 20.87,72.82 20.85,72.84 20.85,73.44 21.36,73.87 | 21.36,73.87 | 21.36,73.87 21.41,74.28 21.44,74.66 21.48,74.7 21.48,75.02 21.48,75.05 | 21.48,75.05 | 21.48,75.05 21.5,75.21 21.48,75.23 21.51,75.25 21.51,75.67 21.32,75.85 JP3.5 | 18.33,70.29 18.39,70.35 18.42,70.35 18.96,70.35 20.64,72.03 | 20.64,72.03 | 18.33,70.29
  Bottom 0.305: v29.01,32.6 29.01,31.66 29.99,30.68 31.61,30.68 32.06,30.22 32.06,28.87 34.85,26.07 | v38.67,24.58 | 34.85,26.07 | 34.85,26.07 35.94,24.99 37.13,24.99 37.39,25.26 38,25.26 v38.67,24.58
GND  (via drill 0.35, 0.35 pad 0.6)
  Top 0.305: v52.52,29.59 52.38,29.46 52.38,28.2 52.32,28.15 U3.12 50.43,28.15 50.39,28.1 | U3.10 50.69,27.15 50.18,27.66 50.18,27.9 50.39,28.1 | 50.39,28.1 50.52,28.1 | U3.5 46.94,26.65 46.91,26.68 46.91,28.08 v46.73,28.26 | U4.2 v45.87,31.74 | IC3.21 40.79,28.93 40.36,28.49 40.36,27.84 v40.19,27.68 | C60.2 59.39,25.57 v59.4,25.59 | C59.2 v57.34,29.39 v57.35,29.4 | C5.2 v36.84,17.42 | v48.24,25.47 48.24,25.73 47.81,26.17
  Bottom 0.254: U2.P$11 50.22,12.14 | 50.39,11.73 U2.P$10 49.84,11.17
  Bottom 0.305: THERM.1 48.45,6.04 CN4.SPRT@1 48.09,5.08 CN4.SPRT@3 45.14,2.58 | CN4.SPRT@2 40.89,5.08 CN4.SPRT@4 43.84,2.58 | 50.39,11.73 50.39,12.14 | 50.39,12.14 U2.P$21 | 49.84,11.17 49.73,11.06 | 50.22,12.14 50.39,12.14 | v40.19,27.68 40.19,27.7 | 45.14,2.58 CN4.D- | 45.14,2.58 CN4.BASE@1 | 43.84,2.58 43.84,3.69 | 43.84,3.69 43.19,4.34 CN4.GND CN4.ID 43.84,3.69 | 43.84,2.58 CN4.BASE@2 | U1.5 35.45,11.2 U1.P$22 | U1.5 U1.6 | U1.6 U1.7 | U1.10 34.15,11.85 | U1.P$20 33.5,13.15 U1.13 33.5,15.72 33.52,15.75 33.64,15.75 | U1.5 35.45,8.64 35.36,8.55 | U1.6 34.8,8.63 34.78,8.61 | U1.7 34.15,8.63 34.14,8.62 | U1.7 34.15,11.85 | 34.15,11.85 U1.P$18 34.8,11.85 U1.6
  Bottom 0.813: U2.P$21 51.39,12.64 51.61,12.42
  other vias: 25.77,11.61 43.58,20.78 58.61,31.55 24.02,25.98 19.62,58.45 25.58,58.44 31.64,58.44 37.63,58.44 43.62,58.43 49.64,58.43 55.61,58.46 61.66,58.46 67.7,58.44 73.64,58.43 19.6,52.06 25.64,52.07 31.61,52.09 37.64,52.11 43.61,52.08 49.61,52.07 55.62,52.07 61.64,52.07 67.6,52.1 73.63,52.05 19.64,45.5 25.62,45.49 31.65,45.5 37.65,45.5 43.61,45.5 49.66,45.5 55.61,45.5 61.65,45.51 67.61,45.5 73.66,45.61 19.66,39.08 25.63,39.06 31.63,39.1 37.67,39.16 43.67,39.12 49.63,39.09 55.65,39.07 61.64,39.08 67.63,39.07 73.66,38.84 19.62,65.86 25.61,65.81 31.68,65.77 37.69,65.84 43.64,65.8 49.65,65.83 55.62,65.76 61.68,65.8 67.74,65.76 73.7,65.77 57.3,23.44 37.68,21.92 70.93,25.62 53.86,19.53
  pour Bottom: -1.01,-0.52 98.99,-0.52 98.99,99.48 -1.01,99.48
  pour Top: -2.01,-1.52 99.99,-1.52 99.99,100.48 -2.01,100.48
LBO
  Bottom 0.305: T1.B 28.63,16 28.71,16.09 30.11,16.09 30.32,15.88 30.32,14.34 31.45,13.21 31.45,13.15 U1.12
MISO  (via drill 0.35 pad 0.6)
  Top 0.305: 58.34,13.29 55.63,15.99 51.85,15.99 45.31,22.54 | 45.31,22.54 IC3.16 | JP3.2 16.24,71.08 14.83,69.67 | 14.83,69.67 | 14.83,69.67 12.82,67.66 12.82,32.83 14.95,30.71 27.51,30.71 28.21,30 v28.21,29.84 | v44.9,22.63 45.21,22.63 45.31,22.54 | 58.34,13.29 | 60.4,11.65 | 60.4,11.65 62.35,11.65 62.87,11.12 62.95,11.12 62.95,10.61 JP1.1 | 58.34,13.29 59.98,11.65 60.4,11.65
  Bottom 0.305: v44.9,22.63 44.76,22.77 35.28,22.77 v28.21,29.84
MOSI  (via drill 0.35 pad 0.6)
  Top 0.305: v39.58,25.03 41.69,25.03 IC3.15 42.59,24.22 v43.29,23.52 | JP1.4 66.7,12.02 66.58,12.24 66.16,12.66 65.55,12.66 65.36,12.72 65.26,12.66 60.4,12.66 57.11,15.95 56.05,17.01 | 56.05,17.01 | 56.05,17.01 | 55.47,17.01 56.05,17.01 | 55.47,17.01 55.21,17.01 | 51.99,17.3 51.69,17.59 49.82,19.46 | 51.99,17.3 | 51.99,17.3 52.27,17.01 52.59,17.01 55.47,17.01 | 49.82,19.46 47.34,21.95 46.25,23.03 v46.25,23.68 | 49.82,19.46 | 55.47,17.01 | JP3.3 19.81,72.69 19.81,72.67 19.4,72.26 19.3,72.18 18.49,71.37 18,71.37 17.98,71.38 13.84,67.24 13.84,33.25 15.37,31.72 28.14,31.72 29.21,30.65 29.48,30.65 29.91,30.22 | v30.37,29.76 29.91,30.22 | 29.91,30.22
  Bottom 0.305: v43.29,23.52 46.09,23.52 v46.25,23.68 | v30.37,29.76 30.37,29.12 35.7,23.79 38.91,23.79 39.58,24.46 v39.58,25.03
N$1
  Bottom 0.305: U1.3 36.57,11.24 36.59,11.23 U1.4
  Bottom 0.61: U1.4 36.57,10.7 37.14,10.13 L1.P$2
  Bottom 0.813: 36.59,11.23 36.59,11.62
N$2
  Bottom 0.305: R20.1 19.9,11.65 LBO.A
N$3
  Bottom 0.305: 27.77,11.52 R2.2 | 27.77,11.52 27.77,10.21 R1.1 | 27.77,11.52 28.73,11.52 29.05,11.83 30.74,11.83 31.37,11.2 U1.9
N$4
  Bottom 0.305: R5.2 22.32,8.07 ON.A
N$5  (via drill 0.35, 0.35 pad 0.6)
  Top 0.305: v36.33,15.35 35.15,16.54 34.55,16.54 v34.41,16.4 | v32.98,18.06 32.59,17.67 32.59,17.62 32.08,17.11 31.48,16.52 v31.48,16.26
  Bottom 0.305: U1.14 34.15,16.14 v34.41,16.4 34.41,16.67 33.38,17.71 | v36.33,15.35 38.99,15.35 R4.2 | R3.1 31.41,16.19 v31.48,16.26 | 33.38,17.71 33.01,18.08 | 33.38,17.71 33.34,17.71 v32.98,18.06
N$6
  Bottom 0.305: T1.C 22.31,13.71 22.31,13.46 23.68,12.08 R20.2
N$7  (via drill 0.35 pad 0.6)
  Top 0.305: 52.94,6.89 49.99,6.89 49.99,6.97 48.46,8.5 47.5,8.5 47.06,8.94 43.62,8.94 v42.66,7.98 | v55.24,13.63 53.95,13.63 53.22,12.9 53.22,8.53 53.82,7.93 53.82,7.32 53.39,6.89 52.94,6.89 | 52.94,6.89
  Bottom 0.254: U2.P$2 54.91,13.64
  Bottom 0.305: 54.91,13.64 v55.23,13.64 v55.24,13.63 | R7.1 42.38,9.15 42.67,8.86 | v42.66,7.98 42.66,8.85 42.67,8.86 | R6.1 42.67,8.86
N$8
  Bottom 0.305: DONE.C 15.51,14.59 R14.2
N$9  (via drill 0.35 pad 0.6)
  Top 0.305: R14.1 18.42,13.9 25.7,6.62 25.71,6.62 25.82,6.51 29,6.51 30.82,4.69 31.98,4.69 32.79,5.5 32.79,5.69 34.46,7.36 37.37,7.36 38.92,8.9 40.15,8.9 40.7,9.45 46.7,9.45 47.55,10.29 49.41,10.29 50.12,9.59 50.57,9.14 50.57,8.66 51,8.23 51.61,8.23 52.03,8.66 52.03,9.05 v52.3,9.32
  Bottom 0.254: U2.P$7 51.89,9.73 v52.3,9.32
  other vias: 18.42,15.5
N$10  (via drill 0.35 pad 0.6)
  Top 0.305: v53.09,7.63 50.05,7.63 THERM.2
  Bottom 0.305: U2.P$5 53.36,7.9 v53.09,7.63
  other vias: 48.45,9.23
N$11  (via drill 0.35 pad 0.6)
  Top 0.305: v51.3,8.96 51.3,9.13 49.63,10.8 47.34,10.8 46.5,9.96 40.5,9.96 39.94,9.41 38.71,9.41 38.41,9.11 | 38.41,9.11 | 38.41,9.11 37.16,7.86 34.25,7.86 32.28,5.9 32.28,5.71 31.77,5.19 31.04,5.19 29.18,7.05 26.31,7.05 R8.1
  Bottom 0.254: U2.P$8 51.39,9.36
  Bottom 0.305: 51.39,9.36 51.39,9.05 v51.3,8.96
  other vias: 19.92,13.44
N$12
  Bottom 0.305: R8.2 17.45,13.44 CHRG/LBO.C
N$13
  Bottom 0.254: U2.P$12 47.87,12.64 47.76,12.53
  Bottom 0.305: 47.76,12.53 R17.2
N$14
  Top 0.305: IC3.7 36.42,21.16 35.98,20.73 35.98,18.99 C5.1 35.5,18.73 34.77,18.73 32.98,16.95 Y1.3
N$15  (via drill 0.35 pad 0.6)
  Top 0.305: IC3.8 | IC3.8 v37.06,20.76 | C3.1 31.65,20.53 30.02,18.9 | 30.02,18.9 29.77,18.65 | Y1.1 30.08,16.97 29.32,17.74 29.32,18.2 30.02,18.9
  Bottom 0.305: v37.06,20.76 33.84,20.76 C3.1
  other vias: 33.61,20.53
N$16
  Bottom 0.254: U2.P$13 48.1,13.14
  Bottom 0.305: 48.1,13.14 46.32,13.14 R16.2
N$17  (via drill 0.35 pad 0.6)
  Bottom 0.61: LED2.2-DOUT 25.77,61.13 28.04,63.41 28.04,65.54 LED3.4-DIN
  other vias: 25.64,61.13 28.34,65.83
N$18
  Bottom 0.813: 32.76,9.55 32.97,9.55 33.27,9.85
N$19
  Top 0.254: U3.8 50.28,26.09 50.37,26
  Top 0.305: 50.37,26 51.13,26 51.31,26.17 51.91,26.17 52.19,25.89 52.49,25.89 54.63,28.02 R9.2
N$20  (via drill 0.35 pad 0.6)
  Bottom 0.305: STAT2.C 25.24,25.18 R21.2
  other vias: 25.24,26.98 27.49,22.93
N$21
  Top 0.305: STAT3.C 25.24,23.18 R22.2
N$22  (via drill 0.35 pad 0.6)
  Top 0.305: STAT1.C v24.88,28.63
  Bottom 0.305: v24.88,28.63 24.88,28.38 25.98,27.29 25.98,26.45 R23.2
  other vias: 29.49,22.93
N$23
  Bottom 0.305: R24.2 82.52,61.73 SW1.P$2
N$24  (via drill 0.35 pad 0.6)
  Bottom 0.61: LED1.2-DOUT 19.85,61.13 22.12,63.41 22.12,65.61 LED2.4-DIN
  other vias: 19.64,61.13 22.34,65.83
N$25  (via drill 0.35 pad 0.6)
  Bottom 0.61: LED3.2-DOUT 31.85,61.13 33.97,63.26 33.98,63.26 34.37,63.65 34.37,65.8 LED4.4-DIN
  other vias: 31.64,61.13 34.34,65.83
N$26  (via drill 0.35 pad 0.6)
  Bottom 0.61: LED4.2-DOUT 38.19,61.13 40.4,63.34 40.4,65.77 LED5.4-DIN
  other vias: 37.64,61.13 40.34,65.83
N$27  (via drill 0.35 pad 0.6)
  Bottom 0.61: LED5.2-DOUT 44.16,61.13 46.33,63.31 46.33,65.82 LED6.4-DIN
  other vias: 43.64,61.13 46.34,65.83
N$30
  Bottom 0.305: R26.2 80.14,42.91 81.09,43.86 85.84,43.86 SW3.P$2
N$31
  Bottom 0.305: R28.2 7.64,52.78 SW5.P$2
N$32
  Bottom 0.305: SW6.P$2 8.12,43.7 R29.2
N$33
  Bottom 0.305: R27.2 11.64,65.75 SW4.P$2
N$34
  Bottom 0.305: R25.2 79.29,52.98 80.19,53.89 82.51,53.89 SW2.P$2
N$37  (via drill 0.35 pad 0.6)
  Bottom 0.61: LED6.2-DOUT 50,61.13 52.31,63.45 52.31,65.81 LED7.4-DIN
  other vias: 49.64,61.13 52.34,65.83
N$38  (via drill 0.35 pad 0.6)
  Bottom 0.61: LED7.2-DOUT 56.16,61.13 58.29,63.26 58.29,65.78 LED8.4-DIN
  other vias: 55.64,61.13 58.34,65.83
N$39  (via drill 0.35 pad 0.6)
  Bottom 0.61: LED8.2-DOUT 62.16,61.13 64.33,63.31 64.33,65.82 LED9.4-DIN
  other vias: 61.64,61.13 64.34,65.83
N$40  (via drill 0.35 pad 0.6)
  Bottom 0.61: LED9.2-DOUT 68.24,61.13 70.41,63.31 70.41,65.76 LED10.4-DIN
  other vias: 67.64,61.13 70.34,65.83
N$41
  Top 0.61: LED10.2-DOUT 72.85,61.13 72.19,60.47 72.19,58.59 71.13,57.54 18.13,57.54 LED11.4-DIN
N$42  (via drill 0.35 pad 0.6)
  Top 0.61: LED12.4-DIN
  Bottom 0.61: LED11.2-DOUT 19.9,54.63 22.4,57.13 22.4,59.28 LED12.4-DIN
  other vias: 19.64,54.63 22.34,59.33
N$43  (via drill 0.35 pad 0.6)
  Top 0.61: LED13.4-DIN
  Bottom 0.61: LED12.2-DOUT 26.1,54.63 28.32,56.86 28.32,59.32 LED13.4-DIN
  other vias: 25.64,54.63 28.34,59.33
N$44  (via drill 0.35 pad 0.6)
  Top 0.61: LED14.4-DIN
  Bottom 0.61: LED13.2-DOUT 32.13,54.63 34.34,56.84 LED14.4-DIN
  other vias: 31.64,54.63 34.34,59.33
N$45  (via drill 0.35 pad 0.6)
  Top 0.61: LED15.4-DIN
  Bottom 0.61: LED14.2-DOUT 38.13,54.63 40.3,56.8 40.3,59.29 LED15.4-DIN
  other vias: 37.64,54.63 40.34,59.33
N$46  (via drill 0.35 pad 0.6)
  Top 0.61: LED16.4-DIN
  Bottom 0.61: LED15.2-DOUT 44.11,54.63 46.36,56.89 46.36,59.31 LED16.4-DIN
  other vias: 43.64,54.63 46.34,59.33
N$47  (via drill 0.35 pad 0.6)
  Top 0.61: LED17.4-DIN
  Bottom 0.61: LED16.2-DOUT 50.05,54.63 52.36,56.94 52.36,59.32 LED17.4-DIN
  other vias: 49.64,54.63 52.34,59.33
N$48  (via drill 0.35 pad 0.6)
  Top 0.61: LED18.4-DIN
  Bottom 0.61: LED17.2-DOUT 56.2,54.63 58.3,56.73 58.3,59.29 LED18.4-DIN
  other vias: 55.64,54.63 58.34,59.33
N$49  (via drill 0.35 pad 0.6)
  Top 0.61: LED19.4-DIN
  Bottom 0.61: LED18.2-DOUT 62.11,54.63 64.37,56.89 64.37,59.31 LED19.4-DIN
  other vias: 61.64,54.63 64.34,59.33
N$50  (via drill 0.35 pad 0.6)
  Top 0.61: LED20.4-DIN
  Bottom 0.61: LED19.2-DOUT 68.07,54.63 70.33,56.89 70.33,59.32 LED20.4-DIN
  other vias: 67.64,54.63 70.34,59.33
N$51
  Top 0.61: LED20.2-DOUT 72.87,54.63 72.24,54 | 72.24,54 | 72.24,54 72.13,53.9 72.13,52.15 71.15,51.17 18.01,51.17 LED21.4-DIN
N$52  (via drill 0.35 pad 0.6)
  Bottom 0.61: LED21.2-DOUT 20.01,48.13 22.34,50.47 LED22.4-DIN
  other vias: 19.64,48.13 22.34,52.83
N$53  (via drill 0.35 pad 0.6)
  Bottom 0.61: LED22.2-DOUT 26.02,48.13 28.38,50.49 28.38,52.8 LED23.4-DIN
  other vias: 25.64,48.13 28.34,52.83
N$54  (via drill 0.35 pad 0.6)
  Bottom 0.61: LED23.2-DOUT 32.01,48.13 34.3,50.42 34.3,52.79 LED24.4-DIN
  other vias: 31.64,48.13 34.34,52.83
N$55  (via drill 0.35 pad 0.6)
  Bottom 0.61: LED24.2-DOUT 38.13,48.13 40.31,50.31 40.31,52.8 LED25.4-DIN
  other vias: 37.64,48.13 40.34,52.83
N$56  (via drill 0.35 pad 0.6)
  Bottom 0.61: LED25.2-DOUT 43.95,48.13 46.31,50.49 46.31,52.8 LED26.4-DIN
  other vias: 43.64,48.13 46.34,52.83
N$57  (via drill 0.35 pad 0.6)
  Bottom 0.61: LED26.2-DOUT 50.1,48.13 52.33,50.36 52.33,52.82 LED27.4-DIN
  other vias: 49.64,48.13 52.34,52.83
N$58  (via drill 0.35 pad 0.6)
  Bottom 0.61: LED27.2-DOUT 56.02,48.13 58.24,50.36 58.24,52.73 LED28.4-DIN
  other vias: 55.64,48.13 58.34,52.83
N$59  (via drill 0.35 pad 0.6)
  Bottom 0.61: LED28.2-DOUT 62.08,48.13 64.3,50.36 64.3,52.8 LED29.4-DIN
  other vias: 61.64,48.13 64.34,52.83
N$60  (via drill 0.35 pad 0.6)
  Bottom 0.61: LED29.2-DOUT 68.06,48.13 70.33,50.4 70.33,52.82 LED30.4-DIN
  other vias: 67.64,48.13 70.34,52.83
N$61
  Top 0.61: LED30.2-DOUT 72.8,48.13 72.17,47.5 | 72.17,47.5 | 72.17,47.5 72.08,47.42 72.08,45.3 71.39,44.6 18.07,44.6 LED31.4-DIN
N$62  (via drill 0.35 pad 0.6)
  Top 0.305: LED32.4-DIN
  Bottom 0.61: LED31.2-DOUT 20.03,41.63 22.31,43.91 22.31,46.3 LED32.4-DIN
  other vias: 19.64,41.63 22.34,46.33
N$63  (via drill 0.35 pad 0.6)
  Top 0.305: LED33.4-DIN
  Bottom 0.61: LED32.2-DOUT 26.1,41.63 28.29,43.83 28.29,46.28 LED33.4-DIN
  other vias: 25.64,41.63 28.34,46.33
N$64  (via drill 0.35 pad 0.6)
  Top 0.305: LED34.4-DIN
  Bottom 0.61: LED33.2-DOUT 32.03,41.63 34.35,43.95 34.35,46.32 LED34.4-DIN
  other vias: 31.64,41.63 34.34,46.33
N$65  (via drill 0.35 pad 0.6)
  Top 0.61: LED35.4-DIN
  Bottom 0.61: LED34.2-DOUT 37.98,41.63 40.35,44 40.35,46.32 LED35.4-DIN
  other vias: 37.64,41.63 40.34,46.33
N$66  (via drill 0.35 pad 0.6)
  Top 0.61: LED36.4-DIN
  Bottom 0.61: LED35.2-DOUT 44.01,41.63 46.34,43.97 LED36.4-DIN
  other vias: 43.64,41.63 46.34,46.33
N$67  (via drill 0.35 pad 0.6)
  Top 0.61: LED37.4-DIN
  Bottom 0.61: LED36.2-DOUT 50.09,41.63 52.31,43.85 52.31,46.3 LED37.4-DIN
  other vias: 49.64,41.63 52.34,46.33
N$68  (via drill 0.35 pad 0.6)
  Top 0.305: LED38.4-DIN
  Bottom 0.61: LED37.2-DOUT 56.11,41.63 58.34,43.86 LED38.4-DIN
  other vias: 55.64,41.63 58.34,46.33
N$69  (via drill 0.35 pad 0.6)
  Top 0.61: LED39.4-DIN
  Bottom 0.61: LED38.2-DOUT 62.01,41.63 64.29,43.92 64.29,46.28 LED39.4-DIN
  other vias: 61.64,41.63 64.34,46.33
N$70  (via drill 0.35 pad 0.6)
  Top 0.61: LED40.4-DIN
  Bottom 0.61: LED39.2-DOUT 68,41.63 70.32,43.95 70.32,46.31 LED40.4-DIN
  other vias: 67.64,41.63 70.34,46.33
N$71
  Top 0.61: LED40.2-DOUT 72.67,41.63 72.14,41.1 72.14,38.83 71.44,38.14 18.04,38.14 LED41.4-DIN
N$72  (via drill 0.35 pad 0.6)
  Top 0.61: v22.34,39.83 LED42.4-DIN
  Bottom 0.61: LED41.2-DOUT 20.11,35.13 22.36,37.39 22.36,39.81 v22.34,39.83
  other vias: 19.64,35.13
N$73  (via drill 0.35 pad 0.6)
  Top 0.305: LED43.4-DIN v28.34,39.83
  Bottom 0.61: LED42.2-DOUT 26.05,35.13 28.34,37.42 v28.34,39.83
  other vias: 25.64,35.13
N$74  (via drill 0.35 pad 0.6)
  Top 0.61: v34.34,39.83 LED44.4-DIN
  Bottom 0.61: LED43.2-DOUT 31.94,35.13 34.35,37.55 34.35,39.81 v34.34,39.83
  other vias: 31.64,35.13
N$75  (via drill 0.35 pad 0.6)
  Top 0.61: v40.34,39.83 LED45.4-DIN
  Bottom 0.61: LED44.2-DOUT 37.9,35.13 40.33,37.56 v40.33,39.82 v40.34,39.83
  other vias: 37.64,35.13
N$76  (via drill 0.35 pad 0.6)
  Top 0.61: v46.34,39.83 LED46.4-DIN
  Bottom 0.61: LED45.2-DOUT 44.18,35.13 46.31,37.27 46.31,39.8 v46.34,39.83
  other vias: 43.64,35.13
N$77  (via drill 0.35 pad 0.6)
  Top 0.61: v52.34,39.83 LED47.4-DIN
  Bottom 0.61: LED46.2-DOUT 49.89,35.13 52.32,37.56 52.32,39.81 v52.34,39.83
  other vias: 49.64,35.13
N$78  (via drill 0.35 pad 0.6)
  Top 0.61: v58.34,39.83 LED48.4-DIN
  Bottom 0.61: LED47.2-DOUT 56.13,35.13 58.34,37.34 v58.34,39.82 v58.34,39.83
  other vias: 55.64,35.13
N$79  (via drill 0.35 pad 0.6)
  Top 0.61: v64.34,39.83 LED49.4-DIN
  Bottom 0.61: LED48.2-DOUT 62.01,35.13 64.37,37.49 64.37,39.8 v64.34,39.83
  other vias: 61.64,35.13
N$80  (via drill 0.35 pad 0.6)
  Top 0.61: v70.34,39.83 LED50.4-DIN
  Bottom 0.61: LED49.2-DOUT 68.04,35.13 70.33,37.42 70.33,39.81 v70.34,39.83
  other vias: 67.64,35.13
NEO-DOUT
  Top 0.305: IC3.10 39.66,21.34 R19.1
PIXEL_DATA  (via drill 0.35)
  Top 0.305: v34.17,19.38 31.53,19.38 v31.51,19.35 | v13.71,69.58 13.71,69.26 12.32,67.87 12.32,61.07 11.36,60.11 11.36,59.51 11.81,59.05 11.81,36.15 v11.36,35.7
  Bottom 0.305: R19.2 34.91,18.64 v34.17,19.38 | v31.51,19.35 27.7,19.35 23.07,23.99 23.07,31.48 21.72,32.83 14.54,32.83 13.07,34.3 | v13.71,69.58 13.71,68.47 LED1.4-DIN | v11.36,35.7 11.68,35.7 13.07,34.3 | 13.07,34.3
  other vias: 42.36,18.64 16.34,65.83
RESET_PROG  (via drill 0.35, 0.35 pad 0.6)
  Top 0.305: 59.25,14.53 60.61,13.17 64.33,13.17 64.46,13.31 67.14,13.31 JP1.5 | 59.25,14.53 | 59.25,14.53 58.49,15.29 56.26,17.52 52.49,17.52 51.58,18.43 50.33,19.67 50.03,19.97 | R31.1 32.71,30.61 IC3.29 | 50.03,19.97 47.84,22.16 46.98,23.02 46.98,23.98 46.55,24.41 46.22,24.41 v45.29,25.34 | 50.03,19.97 | IC3.29 | IC3.29 v35.39,27.94
  Bottom 0.305: v45.29,25.34 44.71,25.93 39.47,25.93 38.99,26.4 | 35.96,27.36 v35.39,27.94 36.74,26.58 38.81,26.58 38.99,26.4 | 38.99,26.4
RX  (via drill 0.35, 0.35 pad 0.6)
  Top 0.305: 60.77,13.73 60.82,13.68 64.12,13.68 64.42,13.98 67.15,13.98 67.2,13.94 69.68,13.94 | 60.77,13.73 | 60.77,13.73 59.46,15.04 56.47,18.03 54.79,18.03 | 54.79,18.03 | 53.02,18.03 54.79,18.03 | 53.02,18.03 | 69.68,13.94 JP1.7 | 69.68,13.94 | 50.84,19.88 52.08,18.64 52.7,18.03 53.02,18.03 | 50.84,19.88 50.25,20.48 50.24,20.48 47.49,23.23 47.49,24.19 46.77,24.92 46.75,24.92 v45.37,26.3 | 50.84,19.88 | v36.35,28.02 36.12,27.79 36.12,27.63 35.69,27.2 34.99,27.2 IC3.30
  Bottom 0.305: 39.34,26.78 39.02,27.09 37.27,27.09 v36.35,28.02 | 39.34,26.78 | 39.34,26.78 39.68,26.43 45.23,26.43 v45.37,26.3
SCK  (via drill 0.35, 0.35 pad 0.6)
  Top 0.305: 57.71,14.64 59.56,12.78 | 57.71,14.64 | 57.71,14.64 55.84,16.5 55.42,16.5 | 55.42,16.5 | IC3.17 44.02,25.94 44.02,25.05 v44.04,25.03 44.04,24.71 44.06,24.69 44.06,24.51 44.86,23.71 52.06,16.5 55.42,16.5 | JP3.4 18.2,74.63 18.93,73.9 18.93,73.53 19.01,73.44 18.91,72.52 18.2,71.93 17.85,71.97 13.33,67.45 13.33,33.04 15.16,31.21 27.93,31.21 29.17,29.97 v29.17,29.92 | 59.56,12.78 | 59.56,12.78 60.19,12.15 64.85,12.15 JP1.3
  Bottom 0.305: v29.17,29.92 29.21,29.89 29.21,29.57 35.49,23.28 39.12,23.28 | v44.04,25.03 40.62,25.03 40.09,24.5 40.09,24.25 39.77,23.93 | 39.12,23.28 39.77,23.93 | 39.77,23.93 | 39.12,23.28
SCL  (via drill 0.35)
  Top 0.305: R15.1 55.25,23.76 Q2.3 53.77,24.46 53.38,24.07 52.93,24.07 51.98,25.03 51.97,25.03 v51.75,25.25 | IC3.28 35.41,29.28 34.85,29.83 34.85,30.13 37.78,33.05 40.77,33.05 v40.92,33.2 | 45.75,33.15 47.32,31.58 48.15,31.58 v48.52,31.95 | 45.75,33.15 | 45.75,33.15 45.51,33.39 42.81,33.39 v42.33,33.86
  Bottom 0.305: v40.92,33.2 41.66,33.2 v42.33,33.86 | v48.52,31.95 48.9,31.57 48.9,26.82 49.34,26.38 50.13,26.38 50.27,26.24 | v51.75,25.25 51.26,25.25 50.27,26.24 | 50.27,26.24
  other vias: 56.89,22.12
SCL_3.3V  (via drill 0.35, 0.35 pad 0.6)
  Top 0.254: U3.4 49.62,27.15 v49.64,27.13
  Top 0.305: 57.6,26.77 R11.1 57.6,25.83 56.56,24.79 56.14,24.79 55.33,25.6 55.03,25.6 54.64,25.21 Q2.2
  Bottom 0.305: Q2.2 52.83,25.21 52.05,25.99 51.25,25.99 50.78,26.45 | 50.78,26.45 | 50.78,26.45 50.34,26.89 49.87,26.89 v49.64,27.13
  other vias: 53.17,25.21
SDA  (via drill 0.35, 0.35 pad 0.6)
  Top 0.305: R12.1 59.61,23.85 58.12,25.34 57.83,25.34 56.56,24.07 56.56,24.05 v56.28,23.77 | v55.25,22.72 53.56,22.72 Q1.3 53.05,21.81 v53.21,21.65 | v36.52,29.07 | v36.52,29.07 IC3.27 | v47.72,18.57 43.71,18.57 42.44,17.3 42.14,17.3 39.67,19.77 39.56,19.89 39.5,19.83 39.2,19.83 38.1,20.93 38.1,21.23 38.91,22.05 38.91,22.26 38.1,23.07 38.1,23.09 36.8,24.38 36.8,25.29 37.11,25.6 38.82,27.31 39.2,27.69 v39.2,28.56
  Bottom 0.305: v56.28,23.77 56.28,23.74 v55.25,22.72 | v53.21,21.65 52.89,21.65 50.25,19.01 48.16,19.01 v47.72,18.57 | v36.52,29.07 37.23,29.07 37.74,28.56 v39.2,28.56
SDA_3.3V
  Top 0.254: U3.6 49.28,23.83
  Top 0.305: 49.28,23.83 Q1.2 52.43,20.67 52.86,20.67 53.11,20.92 R10.1
SDO  (via drill 0.35 pad 0.6)
  Top 0.254: U3.7 49.78,24.37 v50.01,24.13
  Bottom 0.305: v50.01,24.13 48.93,24.13 R18.2
STAT1
  Top 0.305: IC3.32 33.03,26.92 31.54,28.4 30.93,28.4 | STAT1.A 26.74,28.78 27.12,28.4 30.93,28.4 | 30.93,28.4
STAT2
  Top 0.305: STAT2.A 26.92,26.98 27.32,27.39 30.93,27.39 31.59,26.72 | 31.59,26.72 | 31.59,26.72 32.72,25.59 32.72,25.1 IC3.1
STAT3
  Top 0.305: IC3.2 33.36,24.22 32.92,23.79 32.63,23.79 32.19,24.22 27.5,24.22 STAT3.A
SW1  (via drill 0.35 pad 0.6)
  Top 0.305: IC3.23 39.87,30.29 v41.74,32.16
  Bottom 0.305: C63.1 79.06,63.46 | 79.06,63.46 R24.1 79.06,63.46 | 41.72,32.14 v41.74,32.16 43.88,34.3 72.06,34.3 75.89,38.13 75.89,58.75 78.18,61.03 78.18,63.46 79.06,63.46
SW2  (via drill 0.35 pad 0.6)
  Top 0.305: IC3.24 39.33,30.86 39.77,31.3 39.84,31.3 v40.78,32.24
  Bottom 0.305: R25.1 C64.1 80.77,50.96 76.4,46.59 76.4,37.92 74.86,36.38 | 74.86,36.38 74.75,36.27 | v40.78,32.24 41,32.01 41,31.86 41.43,31.43 42.04,31.43 42.47,31.86 42.47,32.18 44.09,33.79 71.85,33.79 | 71.85,33.79 | 71.85,33.79 72.27,33.79 74.86,36.38
SW3  (via drill 0.35 pad 0.6)
  Top 0.305: IC3.25 38.2,30.86 39.2,31.86 39.36,31.86 v39.82,32.32
  Bottom 0.305: C65.1 R26.1 81.84,41.57 79.7,41.57 76.91,38.77 76.91,37.71 75.07,35.87 | 75.07,35.87 75.06,35.86 | v39.82,32.32 40.04,32.09 40.04,31.93 41.06,30.92 42.25,30.92 42.98,31.65 42.98,31.95 44.31,33.28 71.64,33.28 | 71.64,33.28 | 71.64,33.28 72.48,33.28 75.07,35.87
SW4  (via drill 0.35 pad 0.6)
  Top 0.305: v12.09,59.81 12.09,59.71 12.32,59.48 12.32,32.62 14.74,30.2 22.28,30.2 24.58,27.89 31.14,27.89 33.13,25.9 36.69,25.9 38.31,27.52 38.31,28.41 IC3.26
  Bottom 0.305: R27.1 C66.1 13.34,61.06 v12.09,59.81
SW5  (via drill 0.35 pad 0.6)
  Top 0.305: IC3.19 41.96,28.03 v43.05,29.12 | v36.64,34.07 v17.35,34.07
  Bottom 0.305: R28.1 C67.1 13.73,46.05 13.73,36.18 15.84,34.07 v17.35,34.07 | v43.05,29.12 43.05,29.91 42.51,30.45 42.46,30.41 40.69,30.41 39.4,31.7 39.01,31.7 v36.64,34.07
SW6  (via drill 0.35 pad 0.6)
  Top 0.305: IC3.22 40,29.73 39.56,29.29 38.95,29.29 v38.11,30.13
  Bottom 0.305: R29.1 C68.1 | C68.1 | C68.1 14.76,33.33 25.5,33.33 28.04,35.87 28.65,35.87 32.65,31.87 34.05,31.87 34.95,32.77 35.44,32.77 38.08,30.13 v38.11,30.13
TX  (via drill 0.35, 0.35 pad 0.6)
  Top 0.305: JP1.8 71.16,14.43 70.8,14.8 70.76,14.8 70.71,14.88 69.83,15.14 69.19,14.8 69.14,14.8 69.09,14.74 69.01,14.7 69,14.65 68.88,14.53 64.25,14.53 63.9,14.19 61.03,14.19 60.98,14.24 | 60.98,14.24 59.97,15.25 56.68,18.53 52.91,18.53 52.59,18.85 | 60.98,14.24 | 60.98,14.24 | 50.46,20.98 | 50.46,20.98 51.35,20.09 52.59,18.85 | 52.59,18.85 | v47,25.84 47,25.41 48,24.4 48,23.44 50.46,20.98 | IC3.31 33.71,27.58 34.26,27.03 34.6,26.69 36.06,26.69 37.19,27.82 v37.57,27.82
  Bottom 0.305: v47,25.84 46.87,25.84 45.52,27.18 43.79,27.18 43.55,26.94 39.89,26.94 39.01,27.82 v37.57,27.82
VBAT  (via drill 0.35 pad 0.6, 0.35 pad 1.05)
  Top 0.305: C4.1 26.83,13.99 R13.1
  Top 0.61: v55.12,14.75 54.14,14.75 50.85,11.46 47.06,11.46 46.22,10.62 38.99,10.62 37.75,9.38 | R1.2 28.67,8.81 C1.1 33.26,7.93 33.39,7.93 33.98,8.52 36.89,8.52 37.75,9.38 | 37.75,9.38
  Bottom 0.254: U2.P$20 52.54,15.1
  Bottom 0.305: 32.72,9.64 33.05,9.64 U1.8 | U2.P$1 54.5,14.14 v55.12,14.75 54.77,15.1 52.54,15.1 | T1.E 25.37,14.1 C4.1
  Bottom 0.61: R13.1 31.18,9.64 32.72,9.64 32.72,9.28 31.4,7.96 C1.1 33.22,6.08 L1.P$1
  other vias: 27.16,8.81 31.4,6.08 25.48,13.99 29.89,10.93
VBUS  (via drill 0.35, 0.35 pad 0.6)
  Top 0.305: R6.2 41.03,8.5 40.47,8.5 40.36,8.39 39.13,8.39 37.58,6.85 34.86,6.85 32.19,4.18 30.61,4.18 28.85,5.93 25.56,5.93 18.04,13.45 17.03,13.45 17.03,13.66 v16.47,14.22 16.43,14.22 14.87,15.78 13.54,15.78 v13.04,16.28
  Bottom 0.254: U2.P$9 50.89,9.89 | U2.P$17 51.05,15.1 | 51.58,15.1 U2.P$19 51.89,15.25 | U2.P$4 53.36,12.88 U2.P$3
  Bottom 0.305: 49.62,8.14 49.94,8.46 49.94,8.67 50.85,9.58 | 49.62,8.14 47.6,8.14 46.45,6.98 C8.1 45.54,6.85 R6.2 | CN4.VBUS 45.79,6.86 | 50.89,9.89 50.89,9.62 50.85,9.58 | 51.58,15.1 U2.P$18 | 51.05,15.1 U2.P$18 | U2.P$18 51.39,16.46 51.53,16.6 51.65,16.6 51.71,16.65 | 49.7,8.14 49.62,8.14 | 51.71,16.65 54.25,16.65 55.97,14.93 55.97,13.33 55.81,13.16 55.81,12.95 | 55.81,12.95 55.81,12.63 55.8,12.64 | 51.89,15.25 51.89,16.47 51.71,16.65 | 53.36,12.88 55.74,12.88 | 55.74,12.88 55.81,12.95 | 51.71,16.65 51.53,16.65 | v13.04,16.28 13.04,15.76 DONE.A | v16.47,14.22 16.11,14.22 CHRG/LBO.A | 50.85,9.58 50.85,9.55 50.57,9.27 50.57,8.66 52.33,6.89 53.39,6.89 53.86,7.37 53.86,11.54 53.97,11.65 54.69,11.65 55.6,12.56 55.6,12.74 55.74,12.88
  Bottom 0.61: C8.1 45.79,6.86
  other vias: 42.68,6.85
VLIPO  (via drill 0.35 pad 1.05)
  Top 1.016: v63.9,30.18 64.13,30.42 70.05,30.42 | U$22.P$3 72.12,25.27 71.39,24.53 70.61,24.53 U$22.P$1 U$22.P$2 68.81,29.18 70.05,30.42 | 70.05,30.42 71.28,30.42 U$22.P$3 | U$22.P$3 75.23,25.27 | U$22.P$3 76.43,27.59 C7.1
  Bottom 0.305: U2.P$15 49.43,13.84 U2.P$14 | 49.51,15.81 50.22,15.1 U2.P$16 50.31,15.02 49.79,15.02 49.43,14.66 | 48.8,15.67 48.77,15.7 48.65,15.81
  Bottom 0.406: 50.31,15.02 50.3,15.02 49.51,15.81 48.65,15.81 47.65,14.81 47.65,14.38 48.2,13.84 49.43,13.84 | U2.P$15 49.43,14.66 49.43,15.04 48.8,15.67
  Bottom 0.61: 48.96,13.84 48.96,14.27 48.46,14.76 48.77,15.07 48.77,15.7
  Bottom 0.813: 49.89,19.87 47.62,19.87 46.68,18.93 46.68,17.79 48.65,15.81
  Bottom 1.016: v63.9,30.18 63.89,30.19 60.21,30.19 49.89,19.87
  other vias: 80.03,31.19
(copper drawn outside any net)
  shapes: Bottom area x37, Top area x20

## Text on the board
Bottom: 0x4d 0x63 0x41 0x66 0x65 0x65 / 0x20 0x4c 0x69 0x76 0x65 0x73
tNames: :(){ :|:& };: | + | + | + | ON
bStop: fir3r007 / ichorous / videlen